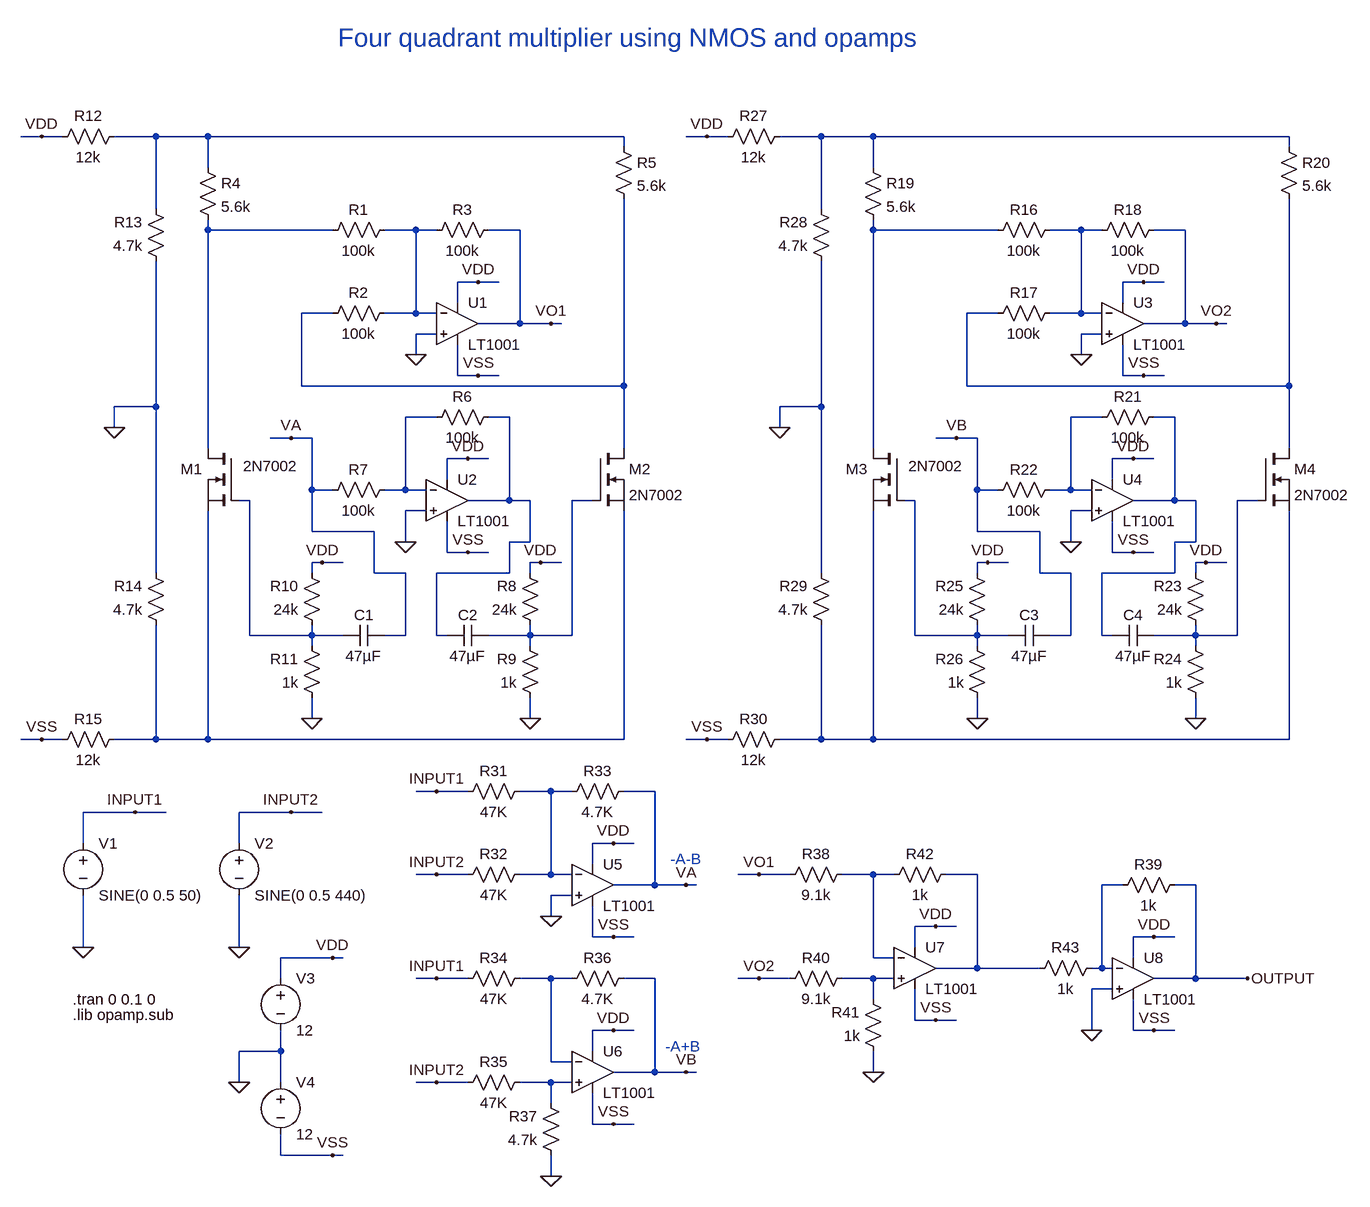
[diagram p0: schematic Draft2.asc]
Draft2.asc, the LTspice schematic file:
Version 4
SHEET 1 1688 1572
WIRE -336 -96 -368 -96
WIRE -304 -96 -336 -96
WIRE -160 -96 -224 -96
WIRE -80 -96 -160 -96
WIRE 560 -96 -80 -96
WIRE 688 -96 656 -96
WIRE 720 -96 688 -96
WIRE 864 -96 800 -96
WIRE 944 -96 864 -96
WIRE 1584 -96 944 -96
WIRE 560 -80 560 -96
WIRE 1584 -80 1584 -96
WIRE -80 -48 -80 -96
WIRE 944 -48 944 -96
WIRE -160 16 -160 -96
WIRE 864 16 864 -96
WIRE -80 48 -80 32
WIRE 112 48 -80 48
WIRE 240 48 192 48
WIRE 272 48 240 48
WIRE 400 48 352 48
WIRE 944 48 944 32
WIRE 1136 48 944 48
WIRE 1264 48 1216 48
WIRE 1296 48 1264 48
WIRE 1424 48 1376 48
WIRE 336 128 304 128
WIRE 368 128 336 128
WIRE 1360 128 1328 128
WIRE 1392 128 1360 128
WIRE 304 160 304 128
WIRE 1328 160 1328 128
WIRE 112 176 64 176
WIRE 240 176 240 48
WIRE 240 176 192 176
WIRE 272 176 240 176
WIRE 1136 176 1088 176
WIRE 1264 176 1264 48
WIRE 1264 176 1216 176
WIRE 1296 176 1264 176
WIRE 400 192 400 48
WIRE 400 192 336 192
WIRE 448 192 400 192
WIRE 464 192 448 192
WIRE 1424 192 1424 48
WIRE 1424 192 1360 192
WIRE 1472 192 1424 192
WIRE 1488 192 1472 192
WIRE 272 208 240 208
WIRE 1296 208 1264 208
WIRE 240 240 240 208
WIRE 1264 240 1264 208
WIRE 304 272 304 224
WIRE 336 272 304 272
WIRE 368 272 336 272
WIRE 1328 272 1328 224
WIRE 1360 272 1328 272
WIRE 1392 272 1360 272
WIRE 64 288 64 176
WIRE 560 288 560 0
WIRE 560 288 64 288
WIRE 1088 288 1088 176
WIRE 1584 288 1584 0
WIRE 1584 288 1088 288
WIRE -160 320 -160 96
WIRE -160 320 -224 320
WIRE 864 320 864 96
WIRE 864 320 800 320
WIRE 272 336 224 336
WIRE 384 336 352 336
WIRE 1296 336 1248 336
WIRE 1408 336 1376 336
WIRE -224 352 -224 320
WIRE 800 352 800 320
WIRE 48 368 16 368
WIRE 80 368 48 368
WIRE 1072 368 1040 368
WIRE 1104 368 1072 368
WIRE -80 384 -80 48
WIRE 560 384 560 288
WIRE 944 384 944 48
WIRE 1584 384 1584 288
WIRE 320 400 288 400
WIRE 352 400 320 400
WIRE 1344 400 1312 400
WIRE 1376 400 1344 400
WIRE 288 432 288 400
WIRE 1312 432 1312 400
WIRE 80 448 80 368
WIRE 112 448 80 448
WIRE 224 448 224 336
WIRE 224 448 192 448
WIRE 256 448 224 448
WIRE 1104 448 1104 368
WIRE 1136 448 1104 448
WIRE 1248 448 1248 336
WIRE 1248 448 1216 448
WIRE 1280 448 1248 448
WIRE -16 464 -32 464
WIRE 384 464 384 336
WIRE 384 464 320 464
WIRE 416 464 384 464
WIRE 512 464 480 464
WIRE 1008 464 992 464
WIRE 1408 464 1408 336
WIRE 1408 464 1344 464
WIRE 1440 464 1408 464
WIRE 1536 464 1504 464
WIRE 256 480 224 480
WIRE 1280 480 1248 480
WIRE 80 512 80 448
WIRE 176 512 80 512
WIRE 1104 512 1104 448
WIRE 1200 512 1104 512
WIRE 224 528 224 480
WIRE 416 528 416 464
WIRE 416 528 384 528
WIRE 1248 528 1248 480
WIRE 1440 528 1440 464
WIRE 1440 528 1408 528
WIRE 288 544 288 496
WIRE 320 544 288 544
WIRE 352 544 320 544
WIRE 1312 544 1312 496
WIRE 1344 544 1312 544
WIRE 1376 544 1344 544
WIRE 96 560 80 560
WIRE 128 560 96 560
WIRE 432 560 416 560
WIRE 464 560 432 560
WIRE 1120 560 1104 560
WIRE 1152 560 1120 560
WIRE 1456 560 1440 560
WIRE 1488 560 1456 560
WIRE -160 576 -160 320
WIRE 80 576 80 560
WIRE 176 576 176 512
WIRE 224 576 176 576
WIRE 384 576 384 528
WIRE 384 576 272 576
WIRE 416 576 416 560
WIRE 864 576 864 320
WIRE 1104 576 1104 560
WIRE 1200 576 1200 512
WIRE 1248 576 1200 576
WIRE 1408 576 1408 528
WIRE 1408 576 1296 576
WIRE 1440 576 1440 560
WIRE -16 672 -16 464
WIRE 80 672 80 656
WIRE 80 672 -16 672
WIRE 128 672 80 672
WIRE 224 672 224 576
WIRE 224 672 192 672
WIRE 272 672 272 576
WIRE 288 672 272 672
WIRE 416 672 416 656
WIRE 416 672 352 672
WIRE 480 672 480 464
WIRE 480 672 416 672
WIRE 1008 672 1008 464
WIRE 1104 672 1104 656
WIRE 1104 672 1008 672
WIRE 1152 672 1104 672
WIRE 1248 672 1248 576
WIRE 1248 672 1216 672
WIRE 1296 672 1296 576
WIRE 1312 672 1296 672
WIRE 1440 672 1440 656
WIRE 1440 672 1376 672
WIRE 1504 672 1504 464
WIRE 1504 672 1440 672
WIRE 80 688 80 672
WIRE 416 688 416 672
WIRE 1104 688 1104 672
WIRE 1440 688 1440 672
WIRE 80 800 80 768
WIRE 416 800 416 768
WIRE 1104 800 1104 768
WIRE 1440 800 1440 768
WIRE -336 832 -368 832
WIRE -304 832 -336 832
WIRE -160 832 -160 656
WIRE -160 832 -224 832
WIRE -80 832 -80 480
WIRE -80 832 -160 832
WIRE 560 832 560 480
WIRE 560 832 -80 832
WIRE 688 832 656 832
WIRE 720 832 688 832
WIRE 864 832 864 656
WIRE 864 832 800 832
WIRE 944 832 944 480
WIRE 944 832 864 832
WIRE 1584 832 1584 480
WIRE 1584 832 944 832
WIRE 272 912 240 912
WIRE 320 912 272 912
WIRE 448 912 400 912
WIRE 480 912 448 912
WIRE 608 912 560 912
WIRE -192 944 -272 944
WIRE -144 944 -192 944
WIRE 48 944 -32 944
WIRE 96 944 48 944
WIRE -272 992 -272 944
WIRE -32 992 -32 944
WIRE 544 992 512 992
WIRE 576 992 544 992
WIRE 512 1024 512 992
WIRE 272 1040 240 1040
WIRE 320 1040 272 1040
WIRE 448 1040 448 912
WIRE 448 1040 400 1040
WIRE 480 1040 448 1040
WIRE 768 1040 736 1040
WIRE 816 1040 768 1040
WIRE 944 1040 896 1040
WIRE 976 1040 944 1040
WIRE 1104 1040 1056 1040
WIRE 608 1056 608 912
WIRE 608 1056 544 1056
WIRE 656 1056 608 1056
WIRE 672 1056 656 1056
WIRE 1328 1056 1296 1056
WIRE 1440 1056 1408 1056
WIRE 480 1072 448 1072
WIRE 448 1104 448 1072
WIRE 1040 1120 1008 1120
WIRE 1072 1120 1040 1120
WIRE 512 1136 512 1088
WIRE 544 1136 512 1136
WIRE 576 1136 544 1136
WIRE 1376 1136 1344 1136
WIRE 1408 1136 1376 1136
WIRE -272 1152 -272 1072
WIRE -32 1152 -32 1072
WIRE 1008 1152 1008 1120
WIRE 112 1168 32 1168
WIRE 128 1168 112 1168
WIRE 944 1168 944 1040
WIRE 976 1168 944 1168
WIRE 1344 1168 1344 1136
WIRE 1104 1184 1104 1040
WIRE 1104 1184 1040 1184
WIRE 1200 1184 1104 1184
WIRE 1296 1184 1296 1056
WIRE 1296 1184 1280 1184
WIRE 1312 1184 1296 1184
WIRE 32 1200 32 1168
WIRE 272 1200 240 1200
WIRE 320 1200 272 1200
WIRE 448 1200 400 1200
WIRE 480 1200 448 1200
WIRE 608 1200 560 1200
WIRE 768 1200 736 1200
WIRE 816 1200 768 1200
WIRE 944 1200 896 1200
WIRE 976 1200 944 1200
WIRE 1440 1200 1440 1056
WIRE 1440 1200 1376 1200
WIRE 1520 1200 1440 1200
WIRE 1312 1216 1280 1216
WIRE 944 1232 944 1200
WIRE 1008 1264 1008 1216
WIRE 1040 1264 1008 1264
WIRE 1072 1264 1040 1264
WIRE 544 1280 512 1280
WIRE 576 1280 544 1280
WIRE 1280 1280 1280 1216
WIRE 1344 1280 1344 1232
WIRE 1376 1280 1344 1280
WIRE 1408 1280 1376 1280
WIRE 32 1312 32 1280
WIRE 32 1312 -32 1312
WIRE 512 1312 512 1280
WIRE 448 1328 448 1200
WIRE 480 1328 448 1328
WIRE 608 1344 608 1200
WIRE 608 1344 544 1344
WIRE 656 1344 608 1344
WIRE 672 1344 656 1344
WIRE 944 1344 944 1312
WIRE -32 1360 -32 1312
WIRE 32 1360 32 1312
WIRE 272 1360 240 1360
WIRE 320 1360 272 1360
WIRE 448 1360 400 1360
WIRE 480 1360 448 1360
WIRE 448 1392 448 1360
WIRE 512 1424 512 1376
WIRE 544 1424 512 1424
WIRE 576 1424 544 1424
WIRE 32 1472 32 1440
WIRE 112 1472 32 1472
WIRE 128 1472 112 1472
WIRE 448 1504 448 1472
FLAG 448 192 VO1
FLAG 240 240 0
FLAG 336 128 VDD
FLAG 336 272 VSS
FLAG 320 400 VDD
FLAG 320 544 VSS
FLAG 224 528 0
FLAG 80 800 0
FLAG 416 800 0
FLAG 96 560 VDD
FLAG 432 560 VDD
FLAG 48 368 VA
FLAG -336 -96 VDD
FLAG -336 832 VSS
FLAG -224 352 0
FLAG 1472 192 VO2
FLAG 1264 240 0
FLAG 1360 128 VDD
FLAG 1360 272 VSS
FLAG 1344 400 VDD
FLAG 1344 544 VSS
FLAG 1248 528 0
FLAG 1104 800 0
FLAG 1440 800 0
FLAG 1120 560 VDD
FLAG 1456 560 VDD
FLAG 1072 368 VB
FLAG 688 -96 VDD
FLAG 688 832 VSS
FLAG 800 352 0
FLAG -192 944 INPUT1
FLAG 48 944 INPUT2
FLAG -272 1152 0
FLAG -32 1152 0
FLAG 656 1056 VA
FLAG 448 1104 0
FLAG 544 992 VDD
FLAG 544 1136 VSS
FLAG 272 912 INPUT1
FLAG 272 1040 INPUT2
FLAG -32 1360 0
FLAG 112 1168 VDD
FLAG 112 1472 VSS
FLAG 656 1344 VB
FLAG 544 1280 VDD
FLAG 544 1424 VSS
FLAG 272 1200 INPUT1
FLAG 448 1504 0
FLAG 272 1360 INPUT2
FLAG 1040 1120 VDD
FLAG 1040 1264 VSS
FLAG 768 1040 VO1
FLAG 944 1344 0
FLAG 768 1200 VO2
FLAG 1376 1136 VDD
FLAG 1376 1280 VSS
FLAG 1520 1200 OUTPUT
FLAG 1280 1280 0
SYMBOL res 208 32 R90
WINDOW 0 0 56 VBottom 2
WINDOW 3 32 56 VTop 2
SYMATTR InstName R1
SYMATTR Value 100k
SYMBOL res 208 160 R90
WINDOW 0 0 56 VBottom 2
WINDOW 3 32 56 VTop 2
SYMATTR InstName R2
SYMATTR Value 100k
SYMBOL res 368 32 R90
WINDOW 0 0 56 VBottom 2
WINDOW 3 32 56 VTop 2
SYMATTR InstName R3
SYMATTR Value 100k
SYMBOL OpAmps\\LT1001 304 128 R0
SYMATTR InstName U1
SYMBOL res -96 -64 R0
SYMATTR InstName R4
SYMATTR Value 5.6k
SYMBOL res 544 -96 R0
SYMATTR InstName R5
SYMATTR Value 5.6k
SYMBOL nmos -32 384 M0
WINDOW 3 -91 27 Left 2
SYMATTR InstName M1
SYMATTR Value 2N7002
SYMBOL OpAmps\\LT1001 288 400 R0
SYMATTR InstName U2
SYMBOL res 368 320 R90
WINDOW 0 0 56 VBottom 2
WINDOW 3 32 56 VTop 2
SYMATTR InstName R6
SYMATTR Value 100k
SYMBOL res 208 432 R90
WINDOW 0 0 56 VBottom 2
WINDOW 3 32 56 VTop 2
SYMATTR InstName R7
SYMATTR Value 100k
SYMBOL nmos 512 384 R0
SYMATTR InstName M2
SYMATTR Value 2N7002
SYMBOL res 432 672 R180
WINDOW 0 36 76 Left 2
WINDOW 3 36 40 Left 2
SYMATTR InstName R8
SYMATTR Value 24k
SYMBOL res 432 784 R180
WINDOW 0 36 76 Left 2
WINDOW 3 36 40 Left 2
SYMATTR InstName R9
SYMATTR Value 1k
SYMBOL res 96 672 R180
WINDOW 0 36 76 Left 2
WINDOW 3 36 40 Left 2
SYMATTR InstName R10
SYMATTR Value 24k
SYMBOL res 96 784 R180
WINDOW 0 36 76 Left 2
WINDOW 3 36 40 Left 2
SYMATTR InstName R11
SYMATTR Value 1k
SYMBOL cap 192 656 R90
WINDOW 0 0 32 VBottom 2
WINDOW 3 32 32 VTop 2
SYMATTR InstName C1
SYMATTR Value 47µF
SYMBOL cap 352 656 R90
WINDOW 0 0 32 VBottom 2
WINDOW 3 32 32 VTop 2
SYMATTR InstName C2
SYMATTR Value 47µF
SYMBOL res -208 -112 R90
WINDOW 0 0 56 VBottom 2
WINDOW 3 32 56 VTop 2
SYMATTR InstName R12
SYMATTR Value 12k
SYMBOL res -144 112 R180
WINDOW 0 36 76 Left 2
WINDOW 3 36 40 Left 2
SYMATTR InstName R13
SYMATTR Value 4.7k
SYMBOL res -144 672 R180
WINDOW 0 36 76 Left 2
WINDOW 3 36 40 Left 2
SYMATTR InstName R14
SYMATTR Value 4.7k
SYMBOL res -208 816 R90
WINDOW 0 0 56 VBottom 2
WINDOW 3 32 56 VTop 2
SYMATTR InstName R15
SYMATTR Value 12k
SYMBOL res 1232 32 R90
WINDOW 0 0 56 VBottom 2
WINDOW 3 32 56 VTop 2
SYMATTR InstName R16
SYMATTR Value 100k
SYMBOL res 1232 160 R90
WINDOW 0 0 56 VBottom 2
WINDOW 3 32 56 VTop 2
SYMATTR InstName R17
SYMATTR Value 100k
SYMBOL res 1392 32 R90
WINDOW 0 0 56 VBottom 2
WINDOW 3 32 56 VTop 2
SYMATTR InstName R18
SYMATTR Value 100k
SYMBOL OpAmps\\LT1001 1328 128 R0
SYMATTR InstName U3
SYMBOL res 928 -64 R0
SYMATTR InstName R19
SYMATTR Value 5.6k
SYMBOL res 1568 -96 R0
SYMATTR InstName R20
SYMATTR Value 5.6k
SYMBOL nmos 992 384 M0
WINDOW 3 -91 27 Left 2
SYMATTR InstName M3
SYMATTR Value 2N7002
SYMBOL OpAmps\\LT1001 1312 400 R0
SYMATTR InstName U4
SYMBOL res 1392 320 R90
WINDOW 0 0 56 VBottom 2
WINDOW 3 32 56 VTop 2
SYMATTR InstName R21
SYMATTR Value 100k
SYMBOL res 1232 432 R90
WINDOW 0 0 56 VBottom 2
WINDOW 3 32 56 VTop 2
SYMATTR InstName R22
SYMATTR Value 100k
SYMBOL nmos 1536 384 R0
SYMATTR InstName M4
SYMATTR Value 2N7002
SYMBOL res 1456 672 R180
WINDOW 0 36 76 Left 2
WINDOW 3 36 40 Left 2
SYMATTR InstName R23
SYMATTR Value 24k
SYMBOL res 1456 784 R180
WINDOW 0 36 76 Left 2
WINDOW 3 36 40 Left 2
SYMATTR InstName R24
SYMATTR Value 1k
SYMBOL res 1120 672 R180
WINDOW 0 36 76 Left 2
WINDOW 3 36 40 Left 2
SYMATTR InstName R25
SYMATTR Value 24k
SYMBOL res 1120 784 R180
WINDOW 0 36 76 Left 2
WINDOW 3 36 40 Left 2
SYMATTR InstName R26
SYMATTR Value 1k
SYMBOL cap 1216 656 R90
WINDOW 0 0 32 VBottom 2
WINDOW 3 32 32 VTop 2
SYMATTR InstName C3
SYMATTR Value 47µF
SYMBOL cap 1376 656 R90
WINDOW 0 0 32 VBottom 2
WINDOW 3 32 32 VTop 2
SYMATTR InstName C4
SYMATTR Value 47µF
SYMBOL res 816 -112 R90
WINDOW 0 0 56 VBottom 2
WINDOW 3 32 56 VTop 2
SYMATTR InstName R27
SYMATTR Value 12k
SYMBOL res 880 112 R180
WINDOW 0 36 76 Left 2
WINDOW 3 36 40 Left 2
SYMATTR InstName R28
SYMATTR Value 4.7k
SYMBOL res 880 672 R180
WINDOW 0 36 76 Left 2
WINDOW 3 36 40 Left 2
SYMATTR InstName R29
SYMATTR Value 4.7k
SYMBOL res 816 816 R90
WINDOW 0 0 56 VBottom 2
WINDOW 3 32 56 VTop 2
SYMATTR InstName R30
SYMATTR Value 12k
SYMBOL voltage -272 976 R0
WINDOW 123 0 0 Left 0
WINDOW 39 0 0 Left 0
SYMATTR InstName V1
SYMATTR Value SINE(0 0.5 50)
SYMBOL voltage -32 976 R0
WINDOW 123 0 0 Left 0
WINDOW 39 0 0 Left 0
SYMATTR InstName V2
SYMATTR Value SINE(0 0.5 440)
SYMBOL res 416 896 R90
WINDOW 0 0 56 VBottom 2
WINDOW 3 32 56 VTop 2
SYMATTR InstName R31
SYMATTR Value 47K
SYMBOL res 416 1024 R90
WINDOW 0 0 56 VBottom 2
WINDOW 3 32 56 VTop 2
SYMATTR InstName R32
SYMATTR Value 47K
SYMBOL res 576 896 R90
WINDOW 0 0 56 VBottom 2
WINDOW 3 32 56 VTop 2
SYMATTR InstName R33
SYMATTR Value 4.7K
SYMBOL OpAmps\\LT1001 512 992 R0
SYMATTR InstName U5
SYMBOL voltage 32 1184 R0
WINDOW 123 0 0 Left 0
WINDOW 39 0 0 Left 0
SYMATTR InstName V3
SYMATTR Value 12
SYMBOL voltage 32 1344 R0
WINDOW 123 0 0 Left 0
WINDOW 39 0 0 Left 0
SYMATTR InstName V4
SYMATTR Value 12
SYMBOL res 416 1184 R90
WINDOW 0 0 56 VBottom 2
WINDOW 3 32 56 VTop 2
SYMATTR InstName R34
SYMATTR Value 47K
SYMBOL res 576 1184 R90
WINDOW 0 0 56 VBottom 2
WINDOW 3 32 56 VTop 2
SYMATTR InstName R36
SYMATTR Value 4.7K
SYMBOL OpAmps\\LT1001 512 1280 R0
SYMATTR InstName U6
SYMBOL res 416 1344 R90
WINDOW 0 0 56 VBottom 2
WINDOW 3 32 56 VTop 2
SYMATTR InstName R35
SYMATTR Value 47K
SYMBOL res 464 1488 R180
WINDOW 0 36 76 Left 2
WINDOW 3 36 40 Left 2
SYMATTR InstName R37
SYMATTR Value 4.7k
SYMBOL res 912 1024 R90
WINDOW 0 0 56 VBottom 2
WINDOW 3 32 56 VTop 2
SYMATTR InstName R38
SYMATTR Value 9.1k
SYMBOL OpAmps\\LT1001 1008 1120 R0
SYMATTR InstName U7
SYMBOL res 912 1184 R90
WINDOW 0 0 56 VBottom 2
WINDOW 3 32 56 VTop 2
SYMATTR InstName R40
SYMATTR Value 9.1k
SYMBOL res 960 1328 R180
WINDOW 0 36 76 Left 2
WINDOW 3 36 40 Left 2
SYMATTR InstName R41
SYMATTR Value 1k
SYMBOL OpAmps\\LT1001 1344 1136 R0
SYMATTR InstName U8
SYMBOL res 1072 1024 R90
WINDOW 0 0 56 VBottom 2
WINDOW 3 32 56 VTop 2
SYMATTR InstName R42
SYMATTR Value 1k
SYMBOL res 1296 1168 R90
WINDOW 0 0 56 VBottom 2
WINDOW 3 32 56 VTop 2
SYMATTR InstName R43
SYMATTR Value 1k
SYMBOL res 1424 1040 R90
WINDOW 0 0 56 VBottom 2
WINDOW 3 32 56 VTop 2
SYMATTR InstName R39
SYMATTR Value 1k
TEXT -288 1232 Left 2 !.tran 0 0.1 0
TEXT -288 1256 Left 2 !.lib opamp.sub
TEXT 632 1016 Left 2 ;-A-B
TEXT 624 1304 Left 2 ;-A+B
TEXT 120 -248 Left 4 ;Four quadrant multiplier using NMOS and opamps

The netlist it stands for:
* Draft2.asc
R1 N004 N003 100k
R2 N004 N007 100k
R3 VO1 N004 100k
XU1 0 N004 VDD VSS VO1 LT1001  ; pins In+ In- V+ V- OUT
R4 N001 N003 5.6k
R5 N001 N007 5.6k
M1 N003 N013 N017 N017 2N7002
XU2 0 N009 VDD VSS N010 LT1001  ; pins In+ In- V+ V- OUT
R6 N010 N009 100k
R7 N009 VA 100k
M2 N007 N014 N017 N017 2N7002
R8 N014 VDD 24k
R9 0 N014 1k
R10 N013 VDD 24k
R11 0 N013 1k
C1 VA N013 47µF
C2 N014 N010 47µF
R12 N001 VDD 12k
R13 0 N001 4.7k
R14 N017 0 4.7k
R15 N017 VSS 12k
R16 N006 N005 100k
R17 N006 N008 100k
R18 VO2 N006 100k
XU3 0 N006 VDD VSS VO2 LT1001  ; pins In+ In- V+ V- OUT
R19 N002 N005 5.6k
R20 N002 N008 5.6k
M3 N005 N015 N018 N018 2N7002
XU4 0 N011 VDD VSS N012 LT1001  ; pins In+ In- V+ V- OUT
R21 N012 N011 100k
R22 N011 VB 100k
M4 N008 N016 N018 N018 2N7002
R23 N016 VDD 24k
R24 0 N016 1k
R25 N015 VDD 24k
R26 0 N015 1k
C3 VB N015 47µF
C4 N016 N012 47µF
R27 N002 VDD 12k
R28 0 N002 4.7k
R29 N018 0 4.7k
R30 N018 VSS 12k
V1 INPUT1 0 SINE(0 0.5 50)
V2 INPUT2 0 SINE(0 0.5 440)
R31 N019 INPUT1 47K
R32 N019 INPUT2 47K
R33 VA N019 4.7K
XU5 0 N019 VDD VSS VA LT1001  ; pins In+ In- V+ V- OUT
V3 VDD 0 12
V4 0 VSS 12
R34 N023 INPUT1 47K
R36 VB N023 4.7K
XU6 N025 N023 VDD VSS VB LT1001  ; pins In+ In- V+ V- OUT
R35 N025 INPUT2 47K
R37 0 N025 4.7k
R38 N020 VO1 9.1k
XU7 N024 N020 VDD VSS N021 LT1001  ; pins In+ In- V+ V- OUT
R40 N024 VO2 9.1k
R41 0 N024 1k
XU8 0 N022 VDD VSS OUTPUT LT1001  ; pins In+ In- V+ V- OUT
R42 N021 N020 1k
R43 N022 N021 1k
R39 OUTPUT N022 1k
.model NMOS NMOS
.model PMOS PMOS
.lib standard.mos
.tran 0 0.1 0
.lib opamp.sub
* -A-B
* -A+B
* Four quadrant multiplier using NMOS and opamps
.lib LTC.lib
.backanno
.end